# EAGLE design esp12_RGB_led (EAGLE 7.3.0)
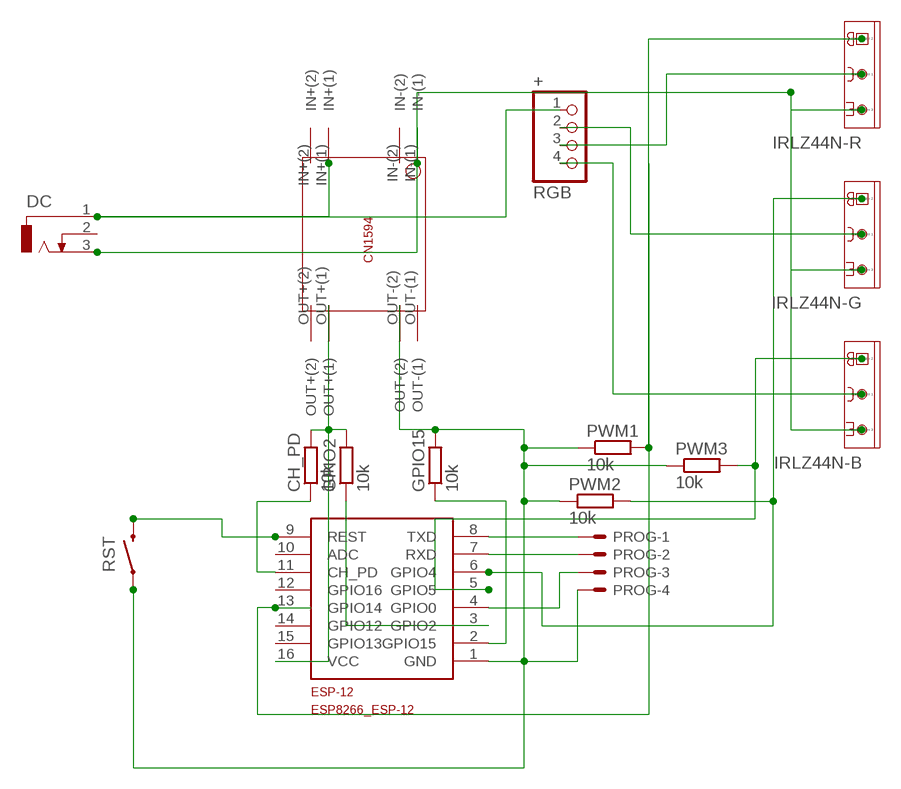
[diagram p0: schematic, sheet 1]

## Parts
+  RGB  PINHD-1X4  [1X04]
CH_PD  10k  R-EU_R0603  [R0603]
DC  DCJ0202  [DCJ0202]
DC_CONVERTER  CN1594THROUGH-HOLE  [CN1594]
ESP-12  ESP8266_ESP-12  [ESP8266-ESP12]
GPIO2  10k  R-EU_R0603  [R0603]
GPIO15  10k  R-EU_R0603  [R0603]
IRLZ44N-B  TIP121  [TO220AV]
IRLZ44N-G  TIP121  [TO220AV]
IRLZ44N-R  TIP121  [TO220AV]
PROG  87438-04  [87438-04]
PWM1  10k  R-EU_R0603  [R0603]
PWM2  10k  R-EU_R0603  [R0603]
PWM3  10k  R-EU_R0603  [R0603]
RST  SWITCH-MOMENTARY-2SMD-1101NE  [TACTILE-SWITCH-1101NE]

## Nets
3.3V [3.3V]: CH_PD.2 DC_CONVERTER.OUT+(1) ESP-12.16(VCC) GPIO2.2
GND [GNDRGB]: DC.3 DC_CONVERTER.IN-(1) IRLZ44N-B.E IRLZ44N-G.E IRLZ44N-R.E
GND3.3V [GND3.3V]: DC_CONVERTER.OUT-(2) ESP-12.1(GND) GPIO15.2 PROG.4 PWM1.1 PWM2.1 PWM3.1 RST.1
N$2 [Signal]: CH_PD.1 ESP-12.11(CH_PD)
N$3: ESP-12.3(GPIO2) GPIO2.1
N$4 [GNDRGB]: +.3 IRLZ44N-R.C
N$5 [Signal]: ESP-12.8(TXD) PROG.1
N$7: ESP-12.2(GPIO15) GPIO15.1
N$8 [Signal]: ESP-12.7(RXD) PROG.2
N$9 [Signal]: ESP-12.4(GPIO0) PROG.3
N$10 [GNDRGB]: +.2 IRLZ44N-G.C
N$11 [GNDRGB]: +.4 IRLZ44N-B.C
N$12 [Signal]: ESP-12.9(REST) RST.2
N$13 [12V]: +.1 DC.1 DC_CONVERTER.IN+(1)
N$16 [Signal]: ESP-12.13(GPIO14) IRLZ44N-R.B PWM1.2
N$24 [Signal]: ESP-12.6(GPIO4) IRLZ44N-G.B PWM2.2
N$25 [Signal]: ESP-12.5(GPIO5) IRLZ44N-B.B PWM3.2
Unconnected: DC.2 DC_CONVERTER.IN+(2) DC_CONVERTER.IN-(2) DC_CONVERTER.OUT+(2) DC_CONVERTER.OUT-(1) ESP-12.10(ADC) ESP-12.12(GPIO16) ESP-12.14(GPIO12) ESP-12.15(GPIO13)

## Library data of the parts
+ = pinhead:PINHD-1X4: PIN HEADER
CH_PD GPIO2 GPIO15 PWM1-PWM3 = rcl:R-EU_: RESISTOR, European symbol
DC = con-jack:DCJ0202: DC POWER JACK Source: DCJ0202.pdf; OC_FARNELL: unknown; OC_NEWARK: unknown
DC_CONVERTER = CN1594_smd:CN1594
ESP-12 = ESP8266-ESP12:ESP8266_ESP-12
IRLZ44N-B IRLZ44N-G IRLZ44N-R = PAsystem:TIP121: TO-220
PROG = con-molex:87438-04: Wire-to-Board 1.50mm (.059") Pitch Header - Right Angle, SMT, Shrouded Source: http://www.molex.com/product/micro/87438.html; OC_FARNELL: unknown; OC_NEWARK: unknown
RST = SparkFun-Electromechanical:SWITCH-MOMENTARY-2: Various NO switches- pushbuttons, reed, etc; PROD_ID: SWCH-00815

## Net classes
1 12V: width 1.016 mm
2 GNDRGB: width 1.016 mm
3 3.3V: width 0.635 mm
4 GND3.3V: width 0.635 mm
5 Signal: width 0.381 mm

## Board
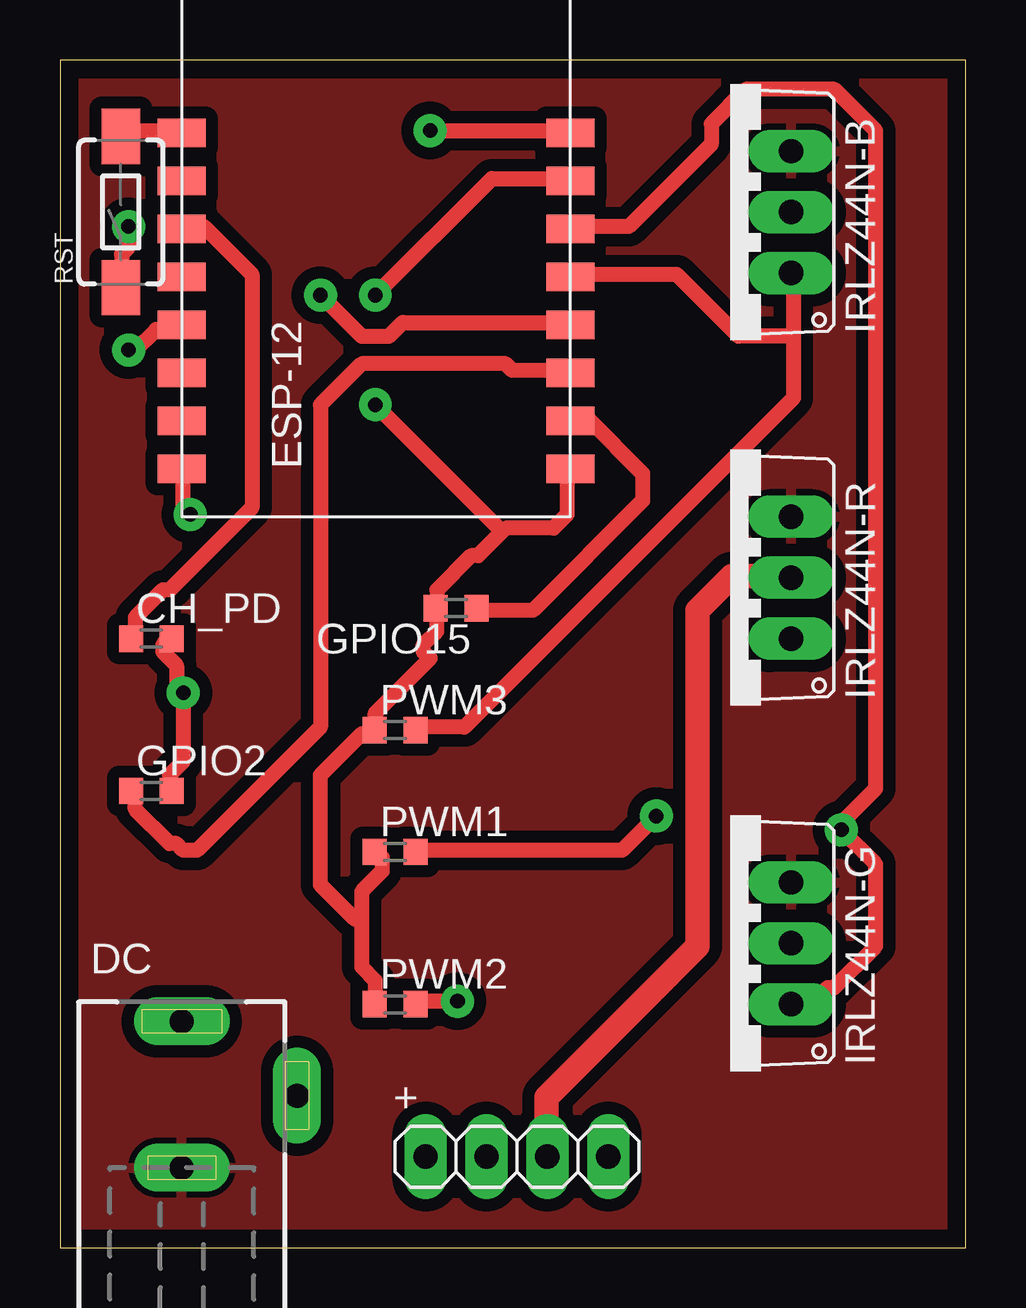
[diagram p1: board, top side]
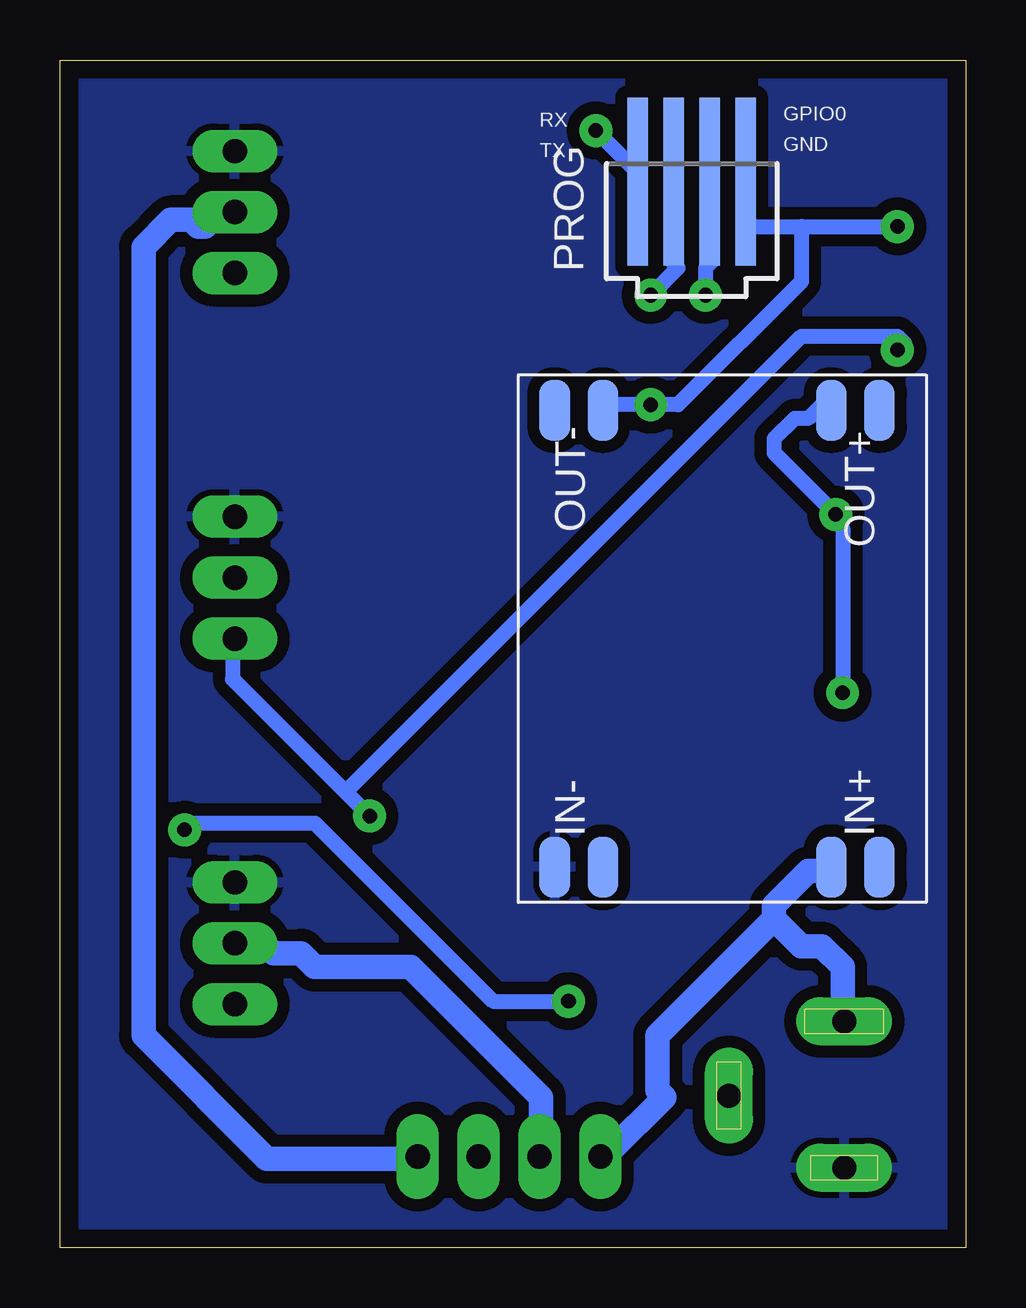
[diagram p2: board, bottom side, seen from below]

Size 37.77 x 49.52 mm. Coordinates in mm from the lower left corner, seen from the top.
Outline: 0,0 37.77,0 37.77,49.52 0,49.52 0,0
Copper layers (1*16): Top 0.035mm / dielectric 1.5mm / Bottom 0.035mm
Design rules "default *": minimum track width 25mil, minimum drill 24mil, track to track 20mil, track to pad 20mil, pad to pad 20mil, via to via 20mil, smd to smd 10mil, copper to edge 30mil, drill to drill 8mil, minimum pad ring 15mil, minimum via ring 15mil, stop-mask expansion 4mil, vias tented up to drill 0mil, thermal gap 10mil

### Footprints (pad centres in the part's own frame; a part is rotated, then mirrored left to right if it is on the bottom)
1X04 = drill 1.016 long: 1 -3.81,0; 2 -1.27,0; 3 1.27,0; 4 3.81,0
R0603 = smd 1 x 1.1: 1 -0.85,0; 2 0.85,0
DCJ0202 = drill 1 pad 2 long: 1 0,3.1; 2 4.8,0; 3 0,-3
CN1594 = smd 2.54 x 1.27: IN+(1) -9.525,-4.547; IN+(2) -9.525,-6.553; IN-(1) -9.525,6.985; IN-(2) -9.525,4.978; OUT+(1) 9.525,-4.547; OUT+(2) 9.525,-6.553; OUT-(1) 9.525,6.985; OUT-(2) 9.525,4.978
ESP8266-ESP12 = smd 2 x 1.2: 1 16.2,2; 2 16.2,4; 3 16.2,6; 4 16.2,8; 5 16.2,10; 6 16.2,12; 7 16.2,14; 8 16.2,16; 9 0,16; 10 0,14; 11 0,12; 12 0,10; 13 0,8; 14 0,6; 15 0,4; 16 0,2
TO220AV = drill 1.016 long: B -2.54,-2.54; C 0,-2.54; E 2.54,-2.54
87438-04 = smd 7 x 0.85: 1 0,2.25; 2 0,0.75; 3 0,-0.75; 4 0,-2.25
TACTILE-SWITCH-1101NE = smd 2.3 x 1.6: 1 -3.15,0; 2 3.15,0

### Placement (x,y rotation side)
+  19.05,3.81 0 top
CH_PD  3.81,25.4 0 top
DC  5.08,6.35 0 top
DC_CONVERTER  10.16,25.4 90 bottom
ESP-12  5.08,30.48 0 top
GPIO2  3.81,19.05 0 top
GPIO15  16.51,26.67 180 top
IRLZ44N-B  27.94,43.18 90 top
IRLZ44N-G  27.94,12.7 90 top
IRLZ44N-R  27.94,27.94 90 top
PROG  11.43,44.45 90 bottom
PWM1  13.97,16.51 0 top
PWM2  13.97,10.16 0 top
PWM3  13.97,21.59 0 top
RST  2.54,43.18 90 top

### Tracks (layer width: path | path; a pad name or v marks a point on that pad's centre or on a via)
3.3V  (via drill 0.61)
  Top 0.635: 5.14,22.86 5.14,20.29 4.57,19.72 4.57,19.14 GPIO2.2 | 5.14,22.86 4.86,23.15 4.86,24.29 4.29,24.86 4.29,25.15 4.57,25.43 CH_PD.2 | v5.43,30.57 5.14,30.86 5.14,32.29 ESP-12.16 | v5.14,23.15 5.14,22.86
  Bottom 0.635: DC_CONVERTER.OUT+(1) 5.43,35.15 5.71,35.43 6.57,34.58 7.14,34.58 8,33.72 8,33.15 v5.43,30.57 5.43,30.29 5.14,30 v5.14,23.15
GND
  pour Top (isolate 0.305): 0,49.53 0,0 38.1,0 38.1,49.53
  pour Bottom: 0,49.53 0,0 38.1,0 38.1,49.53
GND3.3V  (via drill 0.61)
  Top 0.635: v2.86,42.58 2.86,41.72 2.57,41.43 2.57,40.29 RST.1 | 18.43,29.86 18.57,30 20.57,30 21.14,30.57 21.14,32.29 ESP-12.1 | 18.43,29.86 17.43,28.86 17.14,28.86 15.72,27.43 15.72,26.86 GPIO15.2 15.72,26.57 15.72,25.72 15.14,25.15 15.14,24.86 15.43,24.57 13.14,22.29 13.14,21.72 PWM3.1 12.86,21.43 12.57,21.43 10.86,19.72 10.86,15.14 12.29,13.72 12.57,13.72 | 12.57,13.72 12.57,14.86 13.43,15.72 13.43,16.29 13.14,16.57 PWM1.1 | 12.57,13.72 12.57,11.72 13.14,11.14 13.14,10.29 PWM2.1 | 18.43,29.86 v13.14,35.15
  Bottom 0.635: 6.86,42.58 8.86,42.58 9.14,42.86 9.14,44.29 PROG.4 | 6.86,42.58 v2.86,42.58 | 6.86,42.58 6.86,40.29 12,35.15 v13.14,35.15 14.86,35.15 DC_CONVERTER.OUT-(2)
N$2
  Top 0.635: CH_PD.1 3.14,25.43 3.14,26.29 4.29,27.43 4.57,27.43 8,30.86 8,40.58 6,42.58 5.14,42.58 ESP-12.11
N$3
  Top 0.635: GPIO2.1 3.14,18.86 3.14,18.29 4.57,16.86 4.86,16.86 5.14,16.57 5.71,16.57 10.86,21.72 10.86,35.15 12.57,36.86 18.57,36.86 18.86,36.58 21.14,36.58 ESP-12.3
N$4
  Top 1.016: +.3 20.29,4 20.29,6.29 26.57,12.57 26.57,26.57 28,28 30.29,28 IRLZ44N-R.C
N$5  (via drill 0.61)
  Top 0.635: v15.43,46.58 21.14,46.58 ESP-12.8
  Bottom 0.635: v15.43,46.58 13.72,44.86 13.72,44.58 PROG.1
N$7
  Top 0.635: GPIO15.1 17.43,26.57 19.72,26.57 24.29,31.15 24.29,32.29 22,34.58 21.43,34.58 ESP-12.2
N$8  (via drill 0.61)
  Top 0.635: v13.14,39.72 18,44.58 21.14,44.58 ESP-12.7
  Bottom 0.635: v13.14,39.72 12,40.86 12.29,41.15 12.29,44.29 PROG.2
N$9  (via drill 0.61)
  Top 0.635: v10.86,39.72 12.57,38.01 13.72,38.01 14.29,38.58 21.14,38.58 ESP-12.4
  Bottom 0.635: v10.86,39.72 10.86,40.86 10.57,41.15 10.57,44.29 PROG.3
N$10
  Bottom 1.016: +.2 17.72,4 17.72,6.29 23.15,11.72 27.15,11.72 27.72,12.29 28.86,12.29 29.15,12.57 30.29,12.57 IRLZ44N-G.C
N$11
  Bottom 1.016: +.4 22.86,3.71 29.15,3.71 34.29,8.86 34.29,41.72 33.15,42.86 32.29,42.86 32,42.58 31.72,42.58 31.15,43.15 30.57,43.15 IRLZ44N-B.C
N$12
  Top 0.635: ESP-12.9 4.86,46.58 2.57,46.58 RST.2
N$13
  Bottom 1.016: 8,13.72 8,14.29 6.57,15.72 5.71,15.72 DC_CONVERTER.IN+(1) | 8,13.72 6.86,12.57 6,12.57 5.14,11.72 5.14,9.72 DC.1 | 8,13.72 12.86,8.86 12.86,6.57 12.57,6.29 14.86,4 15.14,4 +.1
N$16  (via drill 0.61)
  Top 0.635: v24.86,18 23.43,16.57 14.86,16.57 PWM1.2 | v2.86,37.43 3.14,37.43 4,38.29 4.86,38.29 ESP-12.13
  Bottom 0.635: 25.86,19 30.57,23.72 30.57,25.15 IRLZ44N-R.B | 25.86,19 v24.86,18 | v2.86,37.43 2.57,37.72 2.86,38.01 6.86,38.01 25.86,19
N$24  (via drill 0.61)
  Top 0.635: v16.57,10.29 14.86,10.29 PWM2.2 | IRLZ44N-G.B 30.57,10.29 31.43,10.29 32,10.86 32.29,10.86 34,12.57 34,16 v32.58,17.43 32.58,17.72 34,19.14 34,46.58 32.29,48.29 28.57,48.29 27.15,46.86 27.15,46.01 23.72,42.58 21.43,42.58 ESP-12.6
  Bottom 0.635: v16.57,10.29 19.72,10.29 27.15,17.72 32.29,17.72 v32.58,17.43
N$25
  Top 0.635: 30.57,38.01 30.57,40.58 IRLZ44N-B.B | 30.57,38.01 30.57,35.43 16.86,21.72 14.86,21.72 PWM3.2 | 30.57,38.01 28.29,38.01 25.72,40.58 21.43,40.58 ESP-12.5

### Text on the board
bNames: GPIO0 | RX | GND | TX